# EasyEDA Pro project DIY_Armor_Plate.eprj

# Board DIY_Armor_Plate
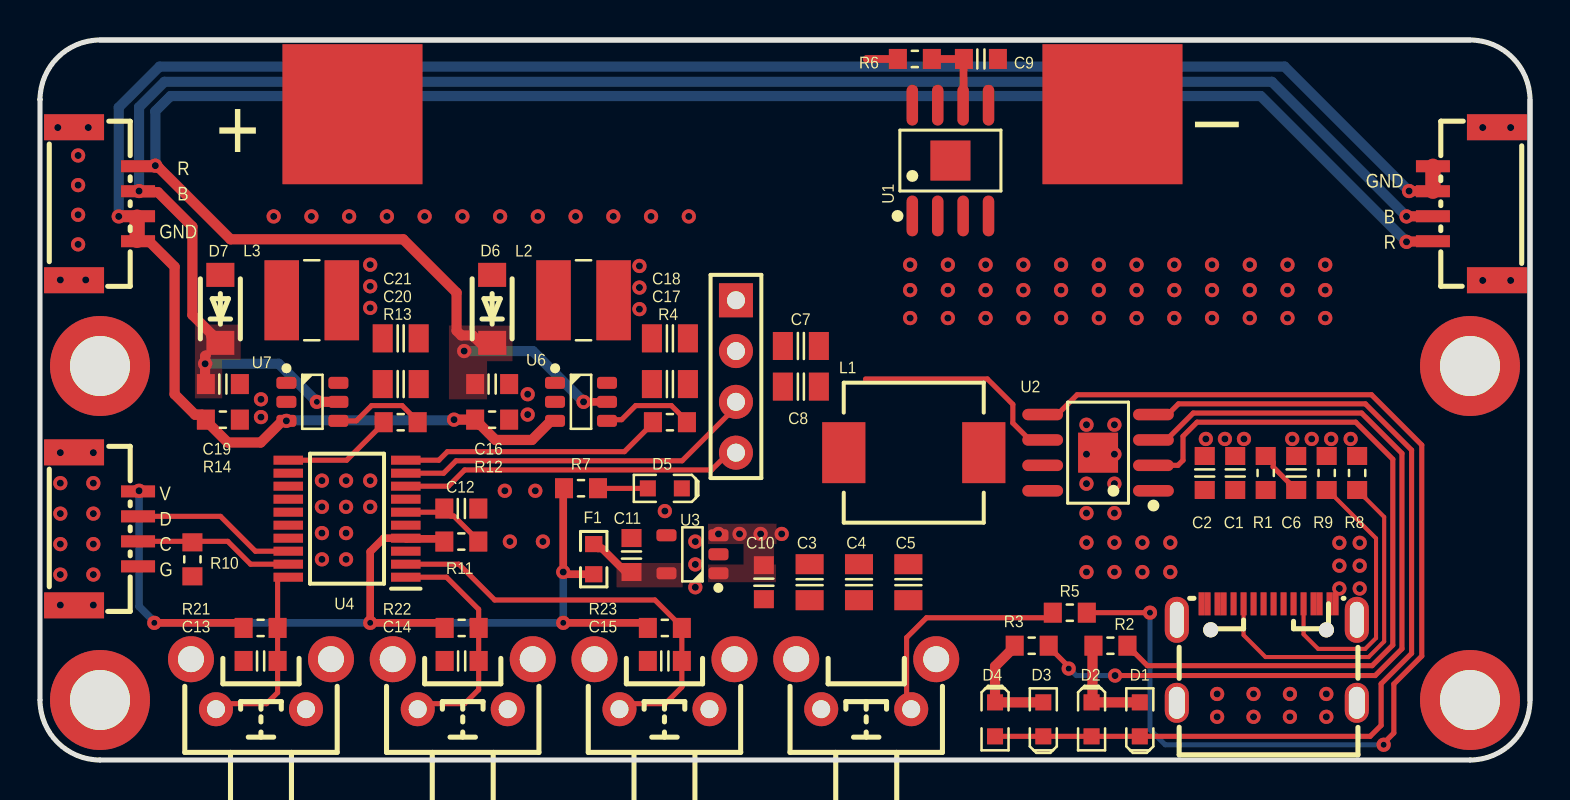
[diagram p0: board, top side]
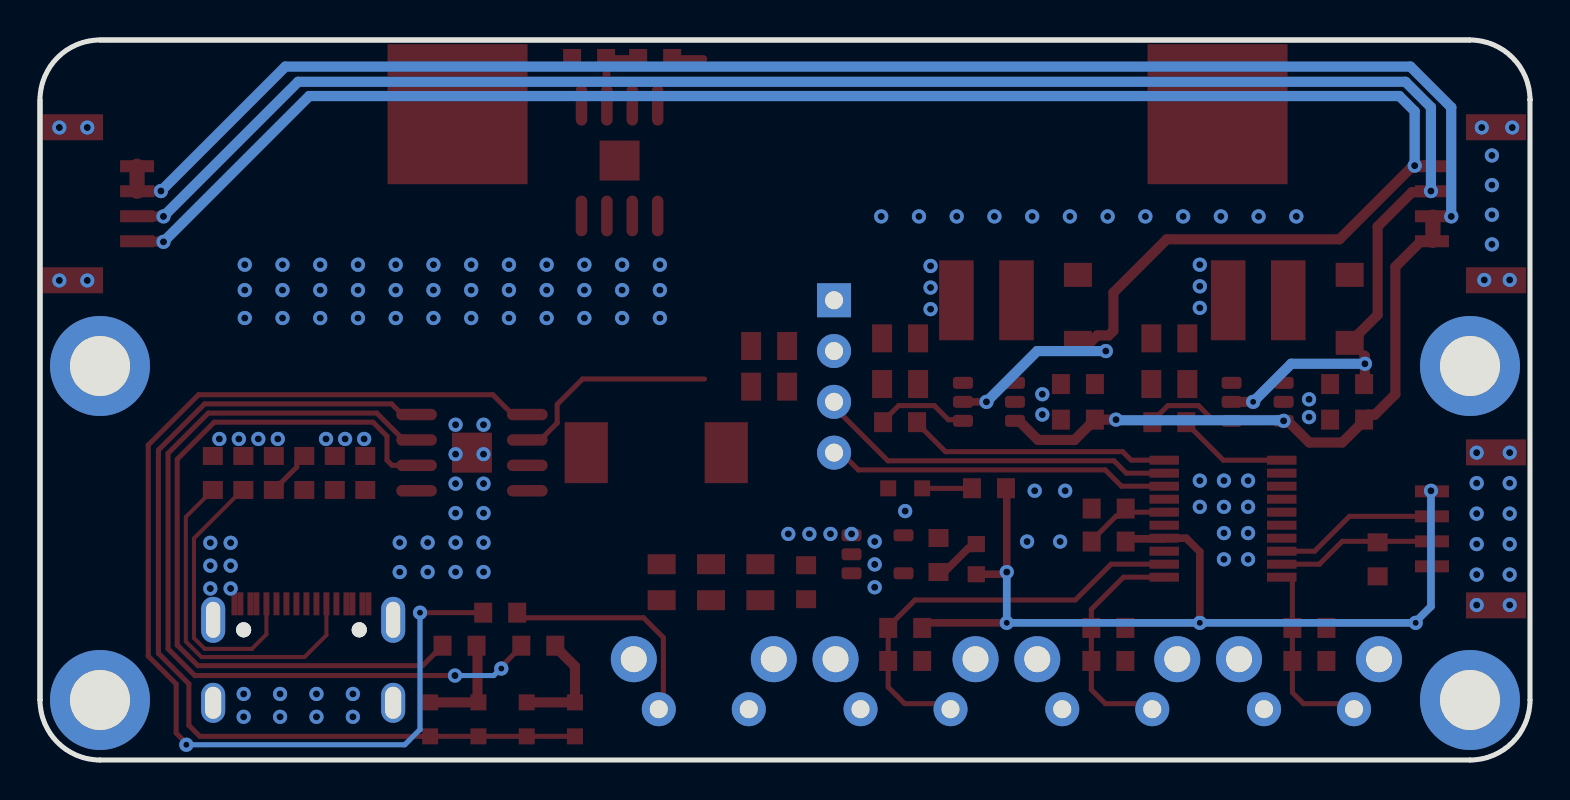
[diagram p1: board, bottom side, seen from below]

Outline 74.5 x 36 mm; copper layers: Top Layer, Bottom Layer. Coordinates in mm from the lower left corner of the outline.
Outline path: 3.05,36 71.44,36 ; 74.5,3 arc(73.62,0.88) 71.5,0 3,0 arc(0.88,0.88) 0,3 0,33.02 0,33 arc(0.88,35.12) 3,36 71.5,36 arc(73.62,35.12) 74.5,33 74.5,3 ; 74.5,3 74.5,32.94
Stack: Top Layer 0.0356mm / Dielectric 1 0.32mm FR-4 er 4.8 / Bottom Layer 0.0356mm

## Design rules (mm)
spacing Clearance (default): track to track 0.203, other pairs 0.203 to 0.203
track width Width (default): min 0.203, default 0.254, max 0.508
track width Width_POWER: min 0.254, default 0.508, max 0.762
differential pair DiffPairsRouting (default): width min 0.381, default 0.381, max 0.381; gap min 0.254, default 0.254
via RoutingVias (default): diameter min 0.508, default 0.711, max 0.711; hole min 0.305, default 0.305, max 0.305

## Placement (name value [footprint] x y rotation side)
C1  10uF  [C_0603]  59.76 14.35 90 top
C2  10uF  [C_0603]  58.24 14.35 90 top
C3  22uF  [C_0805]  38.48 8.89 90 top
C4  22uF  [C_0805]  40.95 8.89 90 top
C5  22uF  [C_0805]  43.42 8.89 90 top
C6  10uF  [C_0603]  62.81 14.35 90 top
C7  22uF  [C_0805]  38.04 20.7 0 top
C8  22uF  [C_0805]  38.04 18.67 0 top
C9  100nF  [C_0603]  47.04 35.05 180 top
C10  10uF  [C_0603]  36.19 8.89 90 top
C11  10uF  [C_0603]  29.57 10.25 270 top
C12  100nF  [C_0603]  21.07 12.57 180 top
C13  100nF  [C_0603]  11.03 4.95 0 top
C14  100nF  [C_0603]  21.08 4.95 0 top
C15  100nF  [C_0603]  31.24 4.95 0 top
C16  470nF  [C_0603]  22.61 18.8 180 top
C17  10uF  [C_0805]  31.5 18.8 180 top
C18  10uF  [C_0805]  31.5 21.08 180 top
C19  470nF  [C_0603]  9.14 18.8 180 top
C20  10uF  [C_0805]  18.03 18.8 180 top
C21  10uF  [C_0805]  18.03 21.08 180 top
D1  LED_0603  [LED_0603_RED]  54.99 2.03 270 top
D2  LED_0603  [LED_0603_RED]  52.58 2.03 90 top
D3  LED_0603  [LED_0603_RED]  50.16 2.03 270 top
D4  LED_0603  [LED_0603_RED]  47.75 2.03 90 top
D5  LED_0603  [LED_0603_BLUE]  31.24 13.58 0 top
D6  MBR0540  [SOD-123]  22.61 20.86 90 top
D7  MBR0540  [SOD-123]  9.02 20.86 90 top
F1  1A  6V  [FUSE_0603]  27.69 10.8 270 top
J1  GH1.25_4P  [GH1.25-WS-4P]  3.3 11.56 270 top
J2  GH1.25_4P  [GH1.25-WS-4P]  71.25 27.81 90 top
J3  GH1.25_4P  [GH1.25-WS-4P]  3.3 27.81 270 top
K1  Key  [TSW DIP-6*6*6_V]  41.31 2.54 0 top
K3  Key  [TSW DIP-6*6*6_V]  11.05 2.54 0 top
K4  Key  [TSW DIP-6*6*6_V]  21.14 2.54 0 top
K5  Key  [TSW DIP-6*6*6_V]  31.22 2.54 0 top
L1  1uH  [IND_7X7]  47.19 15.37 270 top
L2  10uH  [IND_4X4]  27.18 22.99 180 top
L3  10uH  [IND_4X4]  13.59 22.99 180 top
NOREF  -  [Pad_ie14]  53.62 32.29 0 top
NOREF#2  -  [Pad_ie13]  15.62 32.29 0 top
P1  HDR1X4_90F_2.54  [HDR2.54-LI-4P]  34.8 19.18 270 top
P2  VIA  [VIA-3MM#2]  3 19.7 0 top
P3  VIA  [VIA-3MM]  71.5 2.79 0 top
P4  VIA  [VIA-3MM#2]  3 3 0 top
P5  VIA  [VIA-3MM#2]  71.5 19.7 0 top
R1  2R  [R_0603]  61.28 14.35 90 top
R2  1K  [R_0603]  53.52 5.72 180 top
R3  1K  [R_0603]  49.59 5.72 180 top
R4  1K  [R_0603]  31.5 16.89 0 top
R5  10K  [R_0603]  51.49 7.37 180 top
R6  1K  [R_0603]  43.74 35.05 180 top
R7  2K  [R_0603]  27.05 13.59 0 top
R8  5.1K  [R_0603]  65.86 14.35 90 top
R9  5.1K  [R_0603]  64.33 14.35 90 top
R10  10K  [R_0603]  7.62 10.03 90 top
R11  10K  [R_0603]  21.07 10.92 180 top
R12  10R  [R_0603]  22.61 17.02 180 top
R13  1K  [R_0603]  18.03 16.89 0 top
R14  10R  [R_0603]  9.14 17.02 180 top
R21  10K  [R_0603]  11.03 6.6 180 top
R22  10K  [R_0603]  21.08 6.6 180 top
R23  10K  [R_0603]  31.24 6.6 180 top
U1  XB8089D  [SOIC_8(EXPOSED PAD)]  45.17 30.12 0 top
U2  IP5306_CK  [SOIC_8(EXPOSED PAD)]  52.75 15.01 90 top
U3  XC6220B331MR-G  [SOT23-5]  32.62 10.29 180 top
U4  STM32G030F6P6  [TSSOP_20]  15.35 12.06 180 top
U6  SGM3732YTN6G/TR  [SOT23-6]  27.05 17.91 0 top
U7  SGM3732YTN6G/TR  [SOT23-6]  13.62 17.91 0 top
USB1  TYPE-C-16M-005  [USB-C-SMD_KH-TYPE-C-16P]  61.34 5.33 0 top

## Footprints (pads in the part's own frame, mm; a bottom-side part is the same pattern mirrored in y, then rotated)
C_0603
  rect 0.9x1 smd: 1(-0.85,0) 2(0.85,0)
C_0805
  rect 1x1.4 smd: 1(-0.9,0) 2(0.9,0)
FUSE_0603
  rect 0.806x0.864 smd: 1(0,0) 2(1.506,0)
GH1.25-WS-4P
  rect 0.6x1.7 smd: 1(1.875,1.6) 2(0.625,1.6) 3(-0.625,1.6) 4(-1.875,1.6)
  rect 1.3x3 smd: 5(3.825,-1.6) 6(-3.825,-1.6)
HDR2.54-LI-4P
  rect 1.7x1.7 hole 0.9: 1(-3.81,0)
  round 1.7 hole 0.9: 2(-1.27,0) 3(1.27,0) 4(3.81,0)
IND_4X4
  rect 1.727x4 smd: 1(-1.502,0) 2(1.502,0)
IND_7X7
  rect 3.048x2.159 smd: 1(0,0) 2(0,-7)
LED_0603_BLUE
  rect 0.8x0.8 smd: 1(-0.85,0) 2(0.85,0)
LED_0603_RED
  rect 0.8x0.8 smd: 1(-0.85,0) 2(0.85,0)
Pad_ie13
  rect 7x7 smd: 1(0,0)
Pad_ie14
  rect 7x7 smd: 1(0,0)
R_0603
  rect 0.9x1 smd: 1(-0.85,0) 2(0.85,0)
SOD-123
  rect 1.2x1.4 smd: 1(3.4,0) 2(0,0)
SOIC_8(EXPOSED PAD)
  oval 0.574x2.038 smd: 1(-1.552,-2.918) 2(-0.282,-2.918) 3(0.988,-2.918) 4(2.257,-2.918) 5(2.257,2.62) 6(0.988,2.62) 7(-0.282,2.62) 8(-1.552,2.62)
  rect 2x2 smd: 9(0.352,-0.149)
SOT23-5
  rrect 1x0.6 smd: 1(-1.3,0.95) 2(-1.3,0) 3(-1.3,-0.95) 4(1.3,-0.95) 5(1.3,0.95)
SOT23-6
  rrect 1x0.6 smd: 1(-1.3,0.95) 2(-1.3,0) 3(-1.3,-0.95) 4(1.3,-0.95) 5(1.3,0) 6(1.3,0.95)
TSSOP_20
  rect 1.475x0.45 smd: 1(-2.938,2.925) 2(-2.938,2.275) 3(-2.938,1.625) 4(-2.938,0.975) 5(-2.938,0.325) 6(-2.938,-0.325) 7(-2.938,-0.975) 8(-2.938,-1.625) 9(-2.938,-2.275) 10(-2.938,-2.925) 11(2.938,-2.925) 12(2.938,-2.275) 13(2.938,-1.625) 14(2.938,-0.975) 15(2.938,-0.325) 16(2.938,0.325) 17(2.938,0.975) 18(2.938,1.625) 19(2.938,2.275) 20(2.938,2.925)
TSW DIP-6*6*6_V
  round 1.7 hole 0.9: 1(-2.25,0) 2(2.25,0)
  round 2.3 hole 1.3: 3(-3.5,2.5) 4(3.5,2.5)
USB-C-SMD_KH-TYPE-C-16P
  oval 1.2x2 hole 0.8x1.6: 17(-4.5,-2.475) 19(4.5,-2.475)
  oval 1.2x2.3 hole 0.7x1.8: 18(-4.5,1.675) 20(4.5,1.675)
  round 0.75 hole 0.75: 21(2.978,1.175) 22(-2.803,1.175)
  rect 0.3x1.15 smd: A1(-3.263,2.474) A4(-2.462,2.471) A5(-1.163,2.475) A6(-0.163,2.475) A7(0.338,2.474) A9(2.638,2.475) A12(3.438,2.475) B1(3.138,2.475) B4(2.337,2.475) B5(1.837,2.475) B6(0.838,2.475) B7(-0.662,2.474) B9(-2.163,2.471) B12(-2.962,2.474)
  rect 0.299x1.148 smd: A8(-1.663,2.475) B8(1.337,2.475)
VIA-3MM
  round 5 hole 3: 0(0,0.206)
VIA-3MM#2
  round 5 hole 3: 0(0,0)

## Nets
3V3: F1.2 J1.4 R7.1 R11.2 R21.2 R22.2 R23.2 U4.4
5V0: C3.2 C4.2 C5.2 C10.2 C17.2 C18.2 C20.2 C21.2 L2.1 L3.1 P1.2 U2.8 U3.1 U3.3 U6.6 U7.6
GND: C1.2 C2.2 C3.1 C4.1 C5.1 C6.2 C7.1 C8.1 C10.1 C11.1 C12.1 C13.1 C14.1 C15.1 C16.1 C17.1 C18.1 C19.1 C20.1 C21.1 D5.2 J1.1 J1.5 J1.6 J2.5 J2.6 J3.5 J3.6 K1.1 K3.2 K4.2 K5.2 P1.1 P2.0 P3.0 P4.0 P5.0 R8.2 R9.2 R10.1 R12.1 R14.1 U1.1 U1.2 U1.3 U1.4 U2.9 U3.2 U4.5 U6.2 U7.2 USB1.17 USB1.18 USB1.19 USB1.20 USB1.A1 USB1.A12 USB1.B1 USB1.B12
VBAT: C7.2 C8.2 L1.2 NOREF#2.1 R6.2 U2.6
VBUS: C1.1 C2.1 R1.1 U2.1 USB1.A4 USB1.A9 USB1.B4 USB1.B9
VCC_B: C19.2 D7.2 J2.3 J3.3 U7.5
VCC_R: C16.2 D6.2 J2.4 J3.4 U6.5
ADC2: P1.3 U4.9
CC1: R8.1 USB1.A5
CC2: R9.1 USB1.B5
EN_B: R13.1 U4.11
EN_R: R4.1 U4.10
GBAT: C9.1 NOREF.1 U1.5 U1.7 U1.8 U1.9
KEY: C14.2 K4.1 R22.1 U4.1
KEY_B: C13.2 K3.1 R21.1 U4.20
KEY_R: C15.2 K5.1 R23.1 U4.2
LED_GND: J2.1 J2.2 J3.1 J3.2 R12.2 R14.2 U6.3 U7.3
NETC6_1: C6.1 R1.2
NETC9_2: C9.2 R6.1 U1.6
NETC11_2: C11.2 F1.1 U3.5
NETD1_1: D1.1 D2.2 R2.2
NETD1_2: D1.2 D2.1 D3.2 D4.1 U2.4
NETD3_1: D3.1 D4.2 R3.2
NETD5_1: D5.1 R7.2
NETD6_1: D6.1 L2.2 U6.1
NETD7_1: D7.1 L3.2 U7.1
NETK1_2: K1.2 R5.2
NETL1_1: L1.1 U2.7
NETR2_1: R2.1 U2.2
NETR3_1: R3.1 U2.3
NETR4_2: R4.2 U6.4
NETR5_1: R5.1 U2.5
NETR13_2: R13.2 U7.4
NRST: C12.2 R11.1 U4.6
RX2: P1.4 U4.8
SWCLK: J1.2 R10.2 U4.19
SWDIO: J1.3 U4.18

Pads without a net: K1 3 4; K3 3 4; K4 3 4; K5 3 4; U3 4; U4 3 7 12 13 14 15 16 17; USB1 21 22 A6 A7 A8 B6 B7 B8

## Via types
v1: diameter 0.711, hole 0.355, Top Layer to Bottom Layer, 155 vias
v2: diameter 0.711, hole 0.305, Top Layer to Bottom Layer, 7 vias

## Routing (per net, layer and track width the routed paths; a pad name or vN(x,y) marks a point on that pad's centre or on a via; arc(x,y) is an arc through that point)
3V3: length 56.3
  Top Layer w0.381: R23.2 30.14,6.86 v2(26.16,6.86) ; v2(5.72,6.86) 9.93,6.86 R21.2 ; R22.2 19.98,6.86 v2(16.51,6.86) 16.51,10.41 17.19,11.09 U4.4 18.32,11.06 20.08,11.06 R11.2 ; 26.2,13.84 26.16,13.8 v1(26.16,9.4) 26.25,9.4 26.36,9.29 F1.2
  Bottom Layer w0.381: v1(26.16,9.4) v2(26.16,6.86) v2(5.72,6.86) 5.72,6.91 4.95,7.68 v1(4.95,13.46)
5V0:
  vias: v1(16.51,24.77) v1(16.51,23.69) v1(16.51,22.61) v1(29.97,24.7) v1(29.97,23.62) v1(29.97,22.54) v1(33.92,11.3) v1(34.98,11.3) v1(36.03,11.3) v1(37.08,11.3)
GND:
  vias: v1(0.89,31.62) v1(1.02,24) v1(1.02,15.37) v1(1.02,13.84) v1(1.02,12.32) v1(1.02,10.8) v1(1.02,9.27) v1(1.02,7.75) v1(1.91,30.23) v1(1.91,28.74) v1(1.91,27.26) v1(1.91,25.78) v1(2.29,24) v1(2.41,31.62) v1(2.67,15.37) v1(2.67,13.84) v1(2.67,12.32) v1(2.67,10.8) v1(2.67,9.27) v1(2.67,7.75) v1(11.05,18.03) v1(11.05,17.14) v1(11.68,27.18) v1(13.57,27.18) v1(14.1,13.97) v1(14.1,12.66) v1(14.1,11.35) v1(14.1,10.03) v1(15.3,13.97) v1(15.3,12.66) v1(15.3,11.35) v1(15.3,10.03) v1(15.46,27.18) v1(16.51,13.97) v1(16.51,12.66) v1(17.34,27.18) v1(19.23,27.18) v1(21.12,27.18) v1(23,27.18) v1(23.24,13.46) v1(23.5,10.92) v1(24.38,18.29) v1(24.38,17.27) v1(24.76,13.46) v1(24.89,27.18) v1(25.15,10.92) v1(26.78,27.18) v1(28.67,27.18) v1(30.55,27.18) v1(31.24,12.45) v1(32.44,27.18) v1(32.77,10.92) v1(32.77,9.78) v1(32.77,8.64) v1(43.51,24.77) v1(43.51,23.5) v1(43.51,22.1) v1(45.39,24.77) v1(45.39,23.5) v1(45.39,22.1) v1(47.28,24.77) v1(47.28,23.5) v1(47.28,22.1) v1(49.17,24.77) v1(49.17,23.5) v1(49.17,22.1) v1(51.05,24.77) v1(51.05,23.5) v1(51.05,22.1) v1(52.32,16.76) v1(52.32,15.29) v1(52.32,13.82) v1(52.32,12.34) v1(52.32,10.87) v1(52.32,9.4) v1(52.94,24.77) v1(52.94,23.5) v1(52.94,22.1) v1(53.72,16.76) v1(53.72,15.29) v1(53.72,13.82) v1(53.72,12.34) v1(53.72,10.87) v1(53.72,9.4) v1(54.83,24.77) v1(54.83,23.5) v1(54.83,22.1) v1(55.12,10.87) v1(55.12,9.4) v1(56.51,10.87) v1(56.51,9.4) v1(56.71,24.77) v1(56.71,23.5) v1(56.71,22.1) v1(58.29,16.05) v1(58.6,24.77) v1(58.6,23.5) v1(58.6,22.1) v1(58.86,3.3) v1(58.86,2.16) v1(59.25,16.05) v1(60.2,16.05) v1(60.49,24.77) v1(60.49,23.5) v1(60.49,22.1) v1(60.68,3.3) v1(60.68,2.16) v1(62.38,24.77) v1(62.38,23.5) v1(62.38,22.1) v1(62.5,3.3) v1(62.5,2.16) v1(62.61,16.05) v1(63.58,16.05) v1(64.26,24.77) v1(64.26,23.5) v1(64.26,22.1) v1(64.32,3.3) v1(64.32,2.16) v1(64.56,16.05) v1(64.97,10.86) v1(64.97,9.72) v1(64.97,8.57) v1(65.53,16.05) v1(65.99,10.86) v1(65.99,9.72) v1(65.99,8.57) v1(72.14,31.62) v1(72.14,23.98) v1(73.53,31.62) v1(73.53,23.98)
VBAT: length 12.2
  Top Layer w0.254: 41.28,19.05 47.37,19.05 48.64,17.78 48.64,16.85 49.49,16 U2.6
  Top Layer w0.381: 41.33,35.05 R6.2
VCC_B: length 91
  Top Layer w0.508: D7.2 8.92,20.86 8.57,21.2 8.57,21.3 7.62,22.25 7.62,26.67 5.9,28.39 5.01,28.39 v1(4.95,28.45) ; 8.29,20.23 8.25,20.19 v1(8.25,19.81) 8.25,18.83 C19.2 ; J2.3 69.64,27.18 68.33,27.18 v1(68.33,27.18) ; v2(13.84,17.91) U7.5
  Bottom Layer w0.508: v1(68.33,27.18) 61.59,33.91 6.22,33.91 4.95,32.64 v1(4.95,28.45) ; v2(13.84,17.91) 11.94,19.81 v1(8.25,19.81)
VCC_R: length 99.8
  Top Layer w0.381: v1(27.18,17.91) U6.5
  Top Layer w0.508: J2.4 69.63,25.92 68.34,25.92 v1(68.33,25.91) ; 5.86,29.69 5.86,29.68 5.92,29.62 5.94,29.62 9.53,26.03 18.16,26.03 20.83,23.37 20.83,21.46 21.06,21.23 21.63,21.23 22.03,20.83 ; J3.4 5.59,29.69
  Bottom Layer w0.508: v1(21.21,20.45) 24.64,20.45 v1(27.18,17.91) ; v1(68.33,25.91) 61.04,33.2 6.53,33.2 5.77,32.44 v1(5.77,29.72)
ADC2: length 18.1
  Top Layer w0.254: P1.3 34.8,17.65 32.11,14.96 20.8,14.96 20.18,14.34 U4.9
CC1: length 17.5
  Top Layer w0.203: R8.1 65.91,13.5 66.26,13.15 66.26,13.1 67.21,12.15 67.21,5.93 66.43,5.15 61.27,5.15 60.18,6.24 USB1.A5
CC2: length 14.1
  Top Layer w0.203: R9.1 64.38,13.5 66.8,11.08 66.8,6.1 66.26,5.55 63.91,5.55 63.18,6.28 USB1.B5
EN_B: length 5.6
  Top Layer w0.254: U4.11 15.33,14.99 17.18,16.84 R13.1
EN_R: length 13.2
  Top Layer w0.254: U4.10 19.94,14.99 20.37,15.42 29.22,15.42 30.65,16.84 R4.1
KEY: length 11.8
  Top Layer w0.254: K4.1 19.16,2.82 21.23,2.82 21.93,3.52 C14.2 R22.1 21.93,7.53 20.32,9.14 U4.1
KEY_B: length 9.7
  Top Layer w0.254: U4.20 11.98,9.14 11.88,9.04 R21.1 C13.2 11.88,3.37 11.33,2.82 9.08,2.82 K3.1
KEY_R: length 21.7
  Top Layer w0.254: U4.2 20.94,9.79 22.73,8 30.75,8 32.09,6.65 R23.1 C15.2 32.09,3.64 31.26,2.82 29.25,2.82 K5.1
LED_GND: length 108.1
  Top Layer w0.508: v1(3.94,27.18) 3.94,27.18 4.9,27.18 J3.2 ; J2.2 69.64,28.44 68.46,28.44 v1(68.45,28.45) ; 4.86,25.98 J3.1 5.45,25.94 6.73,24.66 6.73,18.29 7.75,17.26 8.1,17.26 8.29,17.07 R14.2 ; v1(20.7,17.02) R12.2 21.76,16.97 21.95,16.77 22,16.77 22.77,16 24.6,16 25.55,16.96 25.75,16.96 ; 8.29,16.97 9.39,15.88 11.04,15.88 12.12,16.96 v1(12.32,16.96)
  Top Layer w0.762: 4.86,25.98 4.86,27.14 ; J2.2 J2.1
  Bottom Layer w0.381: 20.67,16.99 v1(20.7,17.02) ; v1(12.32,16.96) 12.35,16.99
  Bottom Layer w0.508: v1(3.94,27.18) 3.94,32.63 5.98,34.67 62.23,34.67 v1(68.45,28.45) ; 12.35,16.99 20.67,16.99
NETC6_1: length 2.4
  Top Layer w0.254: C6.1 62.76,13.5 62.44,13.82 62.44,13.87 61.66,14.65 61.66,14.88 61.34,15.2 R1.2
NETC9_2: length 3.9
  Top Layer w0.381: 46.18,32.76 46.18,35.03 ; R6.1 C9.2
NETC11_2: length 2.5
  Top Layer w0.381: C11.2 29.28,9.4 28.09,10.58 27.9,10.58 F1.1
NETD1_1: length 5.3
  Top Layer w0.508: D1.1 D2.2 52.62,2.93 52.62,5.67 R2.2
NETD1_2: length 48
  Top Layer w0.254: D4.1 D3.2 D2.1 D1.2 66.51,1.18 67.06,1.73 67.06,3.81 68.58,5.33 68.58,15.49 66.27,17.81 56.92,17.81 56.39,17.27 U2.4
NETD3_1: length 5.7
  Top Layer w0.508: D3.1 D4.2 47.75,4.68 48.74,5.67 R3.2
NETD5_1: length 2.5
  Top Layer w0.254: 27.91,13.58 D5.1
NETK1_2: length 11.5
  Top Layer w0.254: K1.2 43.33,2.77 43.33,6.12 44.32,7.11 50.39,7.11 R5.2
NETR2_1: length 37.8
  Top Layer w0.254: R2.1 54.37,5.67 54.69,5.34 54.75,5.34 55.37,4.72 66.61,4.72 67.64,5.75 67.64,15.04 65.79,16.89 57.85,16.89 57.15,16.19 57.15,14.99 56.9,14.73 U2.2
NETR3_1: length 42.5
  Top Layer w0.254: v2(51.44,4.57) 51.44,4.67 50.44,5.67 R3.1 ; U2.3 56.32,16 57.66,17.35 66.08,17.35 68.1,15.33 68.1,5.56 66.76,4.22 v1(53.75,4.22)
  Bottom Layer w0.254: v2(51.44,4.57) 51.46,4.57 51.81,4.22 v1(53.75,4.22)
NETR4_2: length 4.7
  Top Layer w0.254: U6.4 28.41,17.02 29.08,17.02 29.79,17.72 31.57,17.72 32.35,16.94 R4.2
NETR5_1: length 57.2
  Top Layer w0.254: v2(67.18,0.76) 67.18,0.84 67.69,1.35 67.69,3.8 69.09,5.2 69.09,15.75 66.57,18.26 51.86,18.26 50.87,17.27 U2.5 ; R5.1 v2(55.5,7.37)
  Bottom Layer w0.254: v2(55.5,7.37) 55.5,1.52 56.26,0.76 v2(67.18,0.76)
NETR13_2: length 4.7
  Top Layer w0.254: R13.2 18.88,16.94 18.1,17.72 16.58,17.72 15.81,16.96 U7.4
NRST: length 4.4
  Top Layer w0.254: U4.6 20.03,12.39 C12.2 20.22,12.52 20.54,12.2 20.69,12.2 21.92,10.97 R11.1
RX2: length 17.2
  Top Layer w0.254: P1.4 34.44,15.37 33.58,14.5 21.23,14.5 20.42,13.69 U4.8
SWCLK: length 8
  Top Layer w0.254: J1.2 9.39,10.93 10.53,9.79 U4.19
SWDIO: length 8.2
  Top Layer w0.254: J1.3 9.03,12.18 10.77,10.44 U4.18

## Copper pours and planes (outline as drawn; the poured copper is in the pictures)
5V0 on Top Layer: 33.4,9.78 36.79,9.78 36.79,8.89 33.4,8.89
5V0 on Top Layer: 51.25,13.84 51.25,9.65 50.87,9.27 35.76,9.27 35.76,11.81 46.93,11.81 48.97,13.84
5V0 on Top Layer: 27.66,25.27 27.66,18.54 29.05,18.54 29.6,18 31.07,18 31.07,25.27
5V0 on Top Layer: 14.22,25.27 14.22,18.54 15.62,18.54 16.17,18 17.63,18 17.63,25.27
5V0 on Top Layer: 33.4,11.81 36.83,11.81 36.83,10.8 33.4,10.8
5V0 on Top Layer: 35.18,11.81 36.7,11.81 36.7,9.53 35.18,9.53
5V0 on Bottom Layer: 15.75,25.27 15.75,22.1 29.08,22.1 32,19.18 35.94,19.18 35.94,13.72 34.67,12.45 33.27,12.45 33.27,10.67 37.59,10.67 37.59,21.59 33.4,21.59 33.4,22.48 30.61,25.27
VBAT on Top Layer: 12.06,35.81 12.06,28.19 33.73,28.19 38.17,23.75 38.17,13.33 41.35,13.33 41.35,35.81
VBUS on Top Layer: 54.43,13.95 61.92,13.95 61.92,12.7 64.13,10.48 64.13,7.24 63.5,7.24 63.5,8.89 59.44,8.89 59.44,7.24 58.67,7.24 58.67,10.74 56.97,12.45 54.43,12.45
VCC_B on Top Layer: 7.75,21.76 10.03,21.76 10.03,19.99 7.75,19.99
VCC_B on Top Layer: 7.75,21.76 9.11,21.76 9.11,18.08 7.75,18.08
VCC_R on Top Layer: 20.45,21.72 22.35,21.72 22.35,18.03 20.45,18.03
VCC_R on Top Layer: 20.45,21.72 23.62,21.72 23.62,19.94 20.45,19.94
GBAT on Top Layer: 42.35,33.91 45.52,33.91 45.52,31.5 45.65,31.37 47.04,31.37 47.04,35.81 63.68,35.81 63.68,28.58 42.35,28.58
NETC11_2 on Top Layer: 28.83,9.85 32.13,9.85 32.13,8.64 28.83,8.64
NETD6_1 on Top Layer: 21.59,25.53 21.59,23.37 24,23.37 25.02,22.35 25.02,18.54 26.54,18.54 26.54,25.53
NETD7_1 on Top Layer: 8.16,25.53 8.16,23.37 10.57,23.37 11.59,22.35 11.59,18.54 13.11,18.54 13.11,25.53
NETL1_1 on Top Layer: 46.04,16.89 48.33,16.89 48.33,16.26 49.22,15.37 51.25,15.37 51.25,14.1 48.71,14.1 47.95,13.33 46.04,13.33
GND on Top Layer: 0,3 0.88,0.88 3,0 71.5,0 73.62,0.88 74.5,3 74.5,33 73.62,35.12 71.5,36 3,36 0.88,35.12 0,33
GND on Bottom Layer: 0,3 0.88,0.88 3,0 71.5,0 73.62,0.88 74.5,3 74.5,33 73.62,35.12 71.5,36 3,36 0.88,35.12 0,33

## Text on the board
Top Silkscreen Layer: GND | V | D | C | G | R | B | + | _ | 镍片需要弯曲焊接 | 防止电池扯断镍片

# Board RGB灯带
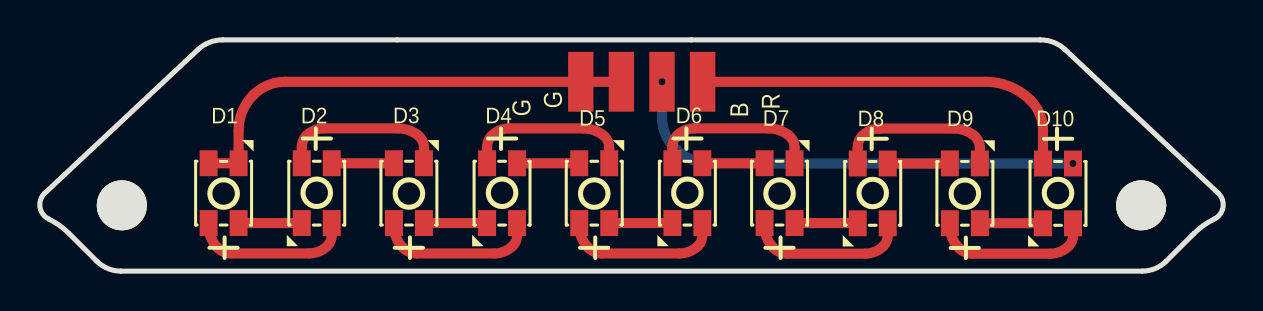
[diagram p2: board, top side]
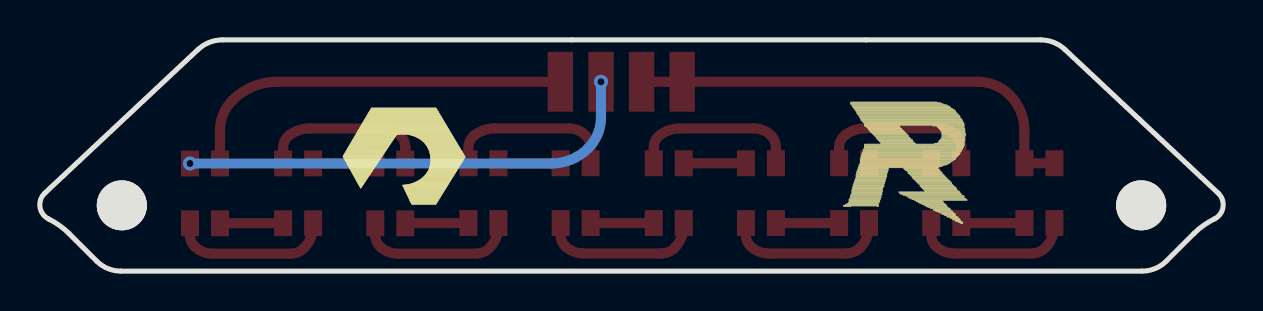
[diagram p3: board, bottom side, seen from below]

Outline 59.19 x 11.6 mm; copper layers: Top Layer, Bottom Layer. Coordinates in mm from the lower left corner of the outline.
Outline path: 0.24,3.91 7.9,11.11 arc(8.47,11.47) 9.14,11.6 50.05,11.6 arc(50.72,11.47) 51.29,11.11 58.95,3.91 arc(59.19,3.21) 58.75,2.61 arc(58.21,2.29) 57.74,1.89 56.35,0.5 arc(55.8,0.13) 55.15,0 4.04,0 arc(3.39,0.13) 2.84,0.5 1.45,1.89 arc(0.98,2.29) 0.44,2.61 arc(0,3.21) 0.24,3.91

## Placement (name value [footprint] x y rotation side)
D1  -  [LED-SMD_4P-L3.2-W2.8-LS3.5-TL]  9.19 3.91 270 top
D2  -  [LED-SMD_4P-L3.2-W2.8-LS3.5-TL]  13.85 3.91 90 top
D3  -  [LED-SMD_4P-L3.2-W2.8-LS3.5-TL]  18.46 3.91 270 top
D4  -  [LED-SMD_4P-L3.2-W2.8-LS3.5-TL]  23.12 3.91 90 top
D5  -  [LED-SMD_4P-L3.2-W2.8-LS3.5-TL]  27.73 3.91 270 top
D6  -  [LED-SMD_4P-L3.2-W2.8-LS3.5-TL]  32.39 3.91 90 top
D7  -  [LED-SMD_4P-L3.2-W2.8-LS3.5-TL]  37 3.91 270 top
D8  -  [LED-SMD_4P-L3.2-W2.8-LS3.5-TL]  41.66 3.9 90 top
D9  -  [LED-SMD_4P-L3.2-W2.8-LS3.5-TL]  46.27 3.9 270 top
D10  -  [LED-SMD_4P-L3.2-W2.8-LS3.5-TL]  50.93 3.9 90 top
NOREF  -  [Pad_ie50]  29.09 9.5 90 top
NOREF#2  -  [Pad_ie49]  31.12 9.5 90 top
NOREF#3  -  [Pad_ie53]  4.09 3.3 270 top
NOREF#4  -  [Pad_ie48]  33.15 9.5 90 top
NOREF#5  -  [Pad_ie51]  27.06 9.5 90 top
NOREF#6  -  [Pad_ie52]  55.09 3.3 270 top

## Footprints (pads in the part's own frame, mm; a bottom-side part is the same pattern mirrored in y, then rotated)
LED-SMD_4P-L3.2-W2.8-LS3.5-TL
  rect 1.3x0.9 smd: 1(-1.5,0.75) 2(1.5,0.75) 3(-1.5,-0.75) 4(1.5,-0.75)
Pad_ie48
  rect 3x1.27 smd: 0(0,0)
Pad_ie49
  rect 3x1.27 smd: 0(0,0)
Pad_ie50
  rect 3x1.27 smd: 0(0,0)
Pad_ie51
  rect 3x1.27 smd: 0(0,0)
Pad_ie52
  round 2.5 hole 2.5: (0,0)
Pad_ie53
  round 2.5 hole 2.5: (0,0)

## Nets
BLUE: D10.4 NOREF#2.0
LED_GND: D1.1 D1.3 NOREF.0 NOREF#5.0
NETD1_2: D1.2 D2.1
NETD1_4: D1.4 D2.3
NETD2_2: D2.2 D3.1
NETD2_4: D2.4 D3.3
NETD3_2: D3.2 D4.1
NETD3_4: D3.4 D4.3
NETD4_2: D4.2 D5.1
NETD4_4: D4.4 D5.3
NETD5_2: D5.2 D6.1
NETD5_4: D5.4 D6.3
NETD6_2: D6.2 D7.1
NETD6_4: D6.4 D7.3
NETD7_2: D7.2 D8.1
NETD7_4: D7.4 D8.3
NETD8_2: D8.2 D9.1
NETD8_4: D8.4 D9.3
NETD9_2: D9.2 D10.1
NETD9_4: D9.4 D10.3
RED: D10.2 NOREF#4.0

## Via types
v1: diameter 0.711, hole 0.355, Top Layer to Bottom Layer, 2 vias

## Routing (per net, layer and track width the routed paths; a pad name or vN(x,y) marks a point on that pad's centre or on a via; arc(x,y) is an arc through that point)
BLUE: length 23.6
  Bottom Layer w0.508: v1(31.12,9.5) 31.12,7.7 arc(31.29,6.87) 31.76,6.17 arc(32.6,5.6) 33.59,5.4 v1(51.68,5.4)
LED_GND: length 23.7
  Top Layer w0.508: D1.3 D1.1 9.94,7.06 arc(10.13,8.02) 10.67,8.84 arc(11.41,9.33) 12.27,9.5 NOREF#5.0 NOREF.0
NETD1_2: length 3.2
  Top Layer w0.508: D1.2 D2.1
NETD1_4: length 8.2
  Top Layer w0.508: D2.3 14.6,1.79 arc(14.54,1.51) 14.38,1.27 arc(13.96,0.99) 13.46,0.89 9.57,0.89 arc(9.21,0.96) 8.9,1.17 arc(8.56,1.67) 8.44,2.27 D1.4
NETD2_2: length 8.7
  Top Layer w0.508: D2.2 13.1,6.22 arc(13.16,6.54) 13.34,6.81 arc(13.74,7.07) 14.2,7.16 17.9,7.16 arc(18.21,7.13) 18.51,7.05 arc(18.71,6.95) 18.89,6.84 arc(19.12,6.55) 19.21,6.2 D3.1
NETD2_4: length 3.1
  Top Layer w0.508: D2.4 D3.3
NETD3_2: length 3.2
  Top Layer w0.508: 19.21,2.41 D4.1
NETD3_4: length 8.2
  Top Layer w0.508: 23.87,2.41 23.87,1.79 arc(23.81,1.5) 23.65,1.27 arc(23.23,0.99) 22.73,0.89 18.84,0.89 arc(18.48,0.96) 18.17,1.17 arc(17.83,1.67) 17.71,2.27 D3.4
NETD4_2: length 8.7
  Top Layer w0.508: 28.48,5.41 28.48,6.19 arc(28.4,6.55) 28.16,6.83 arc(27.98,6.95) 27.78,7.04 arc(27.48,7.13) 27.17,7.16 23.47,7.16 arc(23.01,7.07) 22.61,6.8 arc(22.43,6.53) 22.37,6.22 22.37,5.41
NETD4_4: length 3.1
  Top Layer w0.508: D4.4 D5.3
NETD5_2: length 3.2
  Top Layer w0.508: 28.48,2.41 31.64,2.41 D6.1
NETD5_4: length 8.2
  Top Layer w0.508: D6.3 33.14,1.79 arc(33.08,1.51) 32.93,1.27 arc(32.5,0.99) 32.01,0.89 28.11,0.89 arc(27.75,0.96) 27.44,1.17 arc(27.1,1.67) 26.98,2.27 D5.4
NETD6_2: length 8.7
  Top Layer w0.508: D7.1 37.75,6.2 arc(37.67,6.55) 37.43,6.84 arc(37.25,6.95) 37.05,7.05 arc(36.75,7.13) 36.45,7.16 32.74,7.16 arc(32.28,7.07) 31.88,6.81 arc(31.7,6.54) 31.64,6.22 D6.2
NETD6_4: length 3.1
  Top Layer w0.508: D6.4 D7.3
NETD7_2: length 3.2
  Top Layer w0.508: D7.2 40.88,2.41 arc(40.9,2.41) D8.1
NETD7_4: length 8.2
  Top Layer w0.508: D8.3 42.41,1.77 arc(42.36,1.49) 42.2,1.26 arc(41.77,0.97) 41.28,0.88 37.39,0.88 arc(37.02,0.95) 36.71,1.15 arc(36.37,1.66) 36.25,2.26 36.25,2.4
NETD8_2: length 8.7
  Top Layer w0.508: D9.1 47.02,6.19 arc(46.94,6.54) 46.7,6.83 arc(46.52,6.94) 46.32,7.04 arc(46.03,7.12) 45.72,7.15 42.01,7.15 arc(41.55,7.06) 41.16,6.8 arc(40.98,6.53) 40.91,6.21 40.91,5.4
NETD8_4: length 3.1
  Top Layer w0.508: D8.4 45.52,5.4 D9.3
NETD9_2: length 3.2
  Top Layer w0.508: D10.1 50.18,2.4 D9.2
NETD9_4: length 8.2
  Top Layer w0.508: D10.3 51.68,1.77 arc(51.63,1.49) 51.47,1.26 arc(51.05,0.97) 50.55,0.88 46.66,0.88 arc(46.29,0.95) 45.98,1.15 arc(45.64,1.66) 45.52,2.26 45.52,2.4
RED: length 20
  Top Layer w0.508: NOREF#4.0 47.32,9.5 arc(48.53,9.26) 49.56,8.57 arc(50.02,7.88) 50.18,7.06 D10.2

## Text on the board
Top Silkscreen Layer: G | B | R
